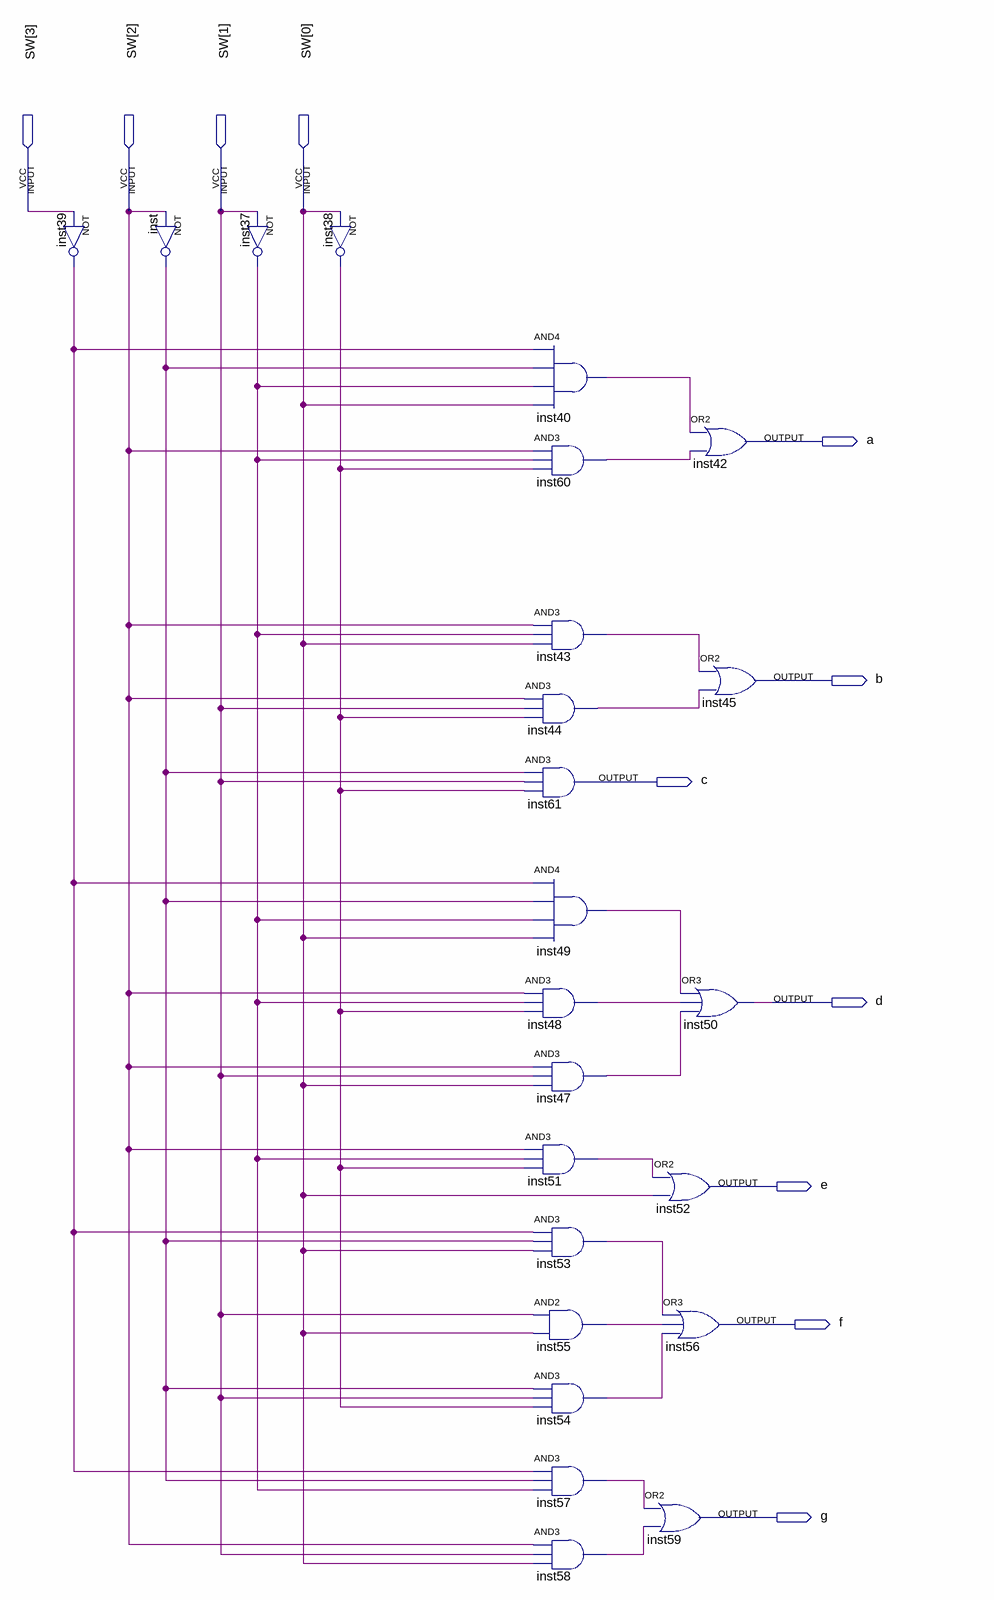
[diagram p0: schematic sheet]
// Quartus schematic display7.bdf as structural Verilog: 24 symbols, 11 pins
module display7 (
  input  [3:0] SW,
  output a,
  output b,
  output c,
  output d,
  output e,
  output f,
  output g
);

  wire inst37_out, inst38_out, inst39_out, inst40_out, inst43_out, inst44_out, inst47_out, inst48_out,
       inst49_out, inst51_out, inst53_out, inst54_out, inst55_out, inst57_out, inst58_out, inst60_out,
       inst_out;

  not inst39 (inst39_out, SW[3]);
  not inst (inst_out, SW[2]);
  not inst37 (inst37_out, SW[1]);
  not inst38 (inst38_out, SW[0]);
  and inst40 (inst40_out, inst39_out, inst_out, inst37_out, SW[0]);
  and inst60 (inst60_out, SW[2], inst37_out, inst38_out);
  and inst43 (inst43_out, SW[2], inst37_out, SW[0]);
  and inst44 (inst44_out, SW[2], SW[1], inst38_out);
  and inst61 (c, inst_out, SW[1], inst38_out);
  and inst49 (inst49_out, inst39_out, inst_out, inst37_out, SW[0]);
  and inst48 (inst48_out, SW[2], inst37_out, inst38_out);
  and inst47 (inst47_out, SW[2], SW[1], SW[0]);
  and inst51 (inst51_out, SW[2], inst37_out, inst38_out);
  and inst53 (inst53_out, inst39_out, inst_out, SW[0]);
  and inst55 (inst55_out, SW[1], SW[0]);
  and inst54 (inst54_out, inst_out, SW[1], inst38_out);
  and inst57 (inst57_out, inst39_out, inst_out, inst37_out);
  and inst58 (inst58_out, SW[2], SW[1], SW[0]);
  or inst42 (a, inst40_out, inst60_out);
  or inst45 (b, inst43_out, inst44_out);
  or inst50 (d, inst49_out, inst48_out, inst47_out);
  or inst52 (e, inst51_out, SW[0]);
  or inst56 (f, inst53_out, inst55_out, inst54_out);
  or inst59 (g, inst57_out, inst58_out);
endmodule
